# EasyEDA Pro project ProProject_esp32s3_reye_2023-09-05.epro

# Schematic Schematic1
Create Date: 2023-08-01; Page Name: P1; Project Name: esp32s3_reye; Schematic Name: Schematic1; Update Date: 2023-08-22; Company: 嘉立创EDA; Page Size: A4; Version: V1.0
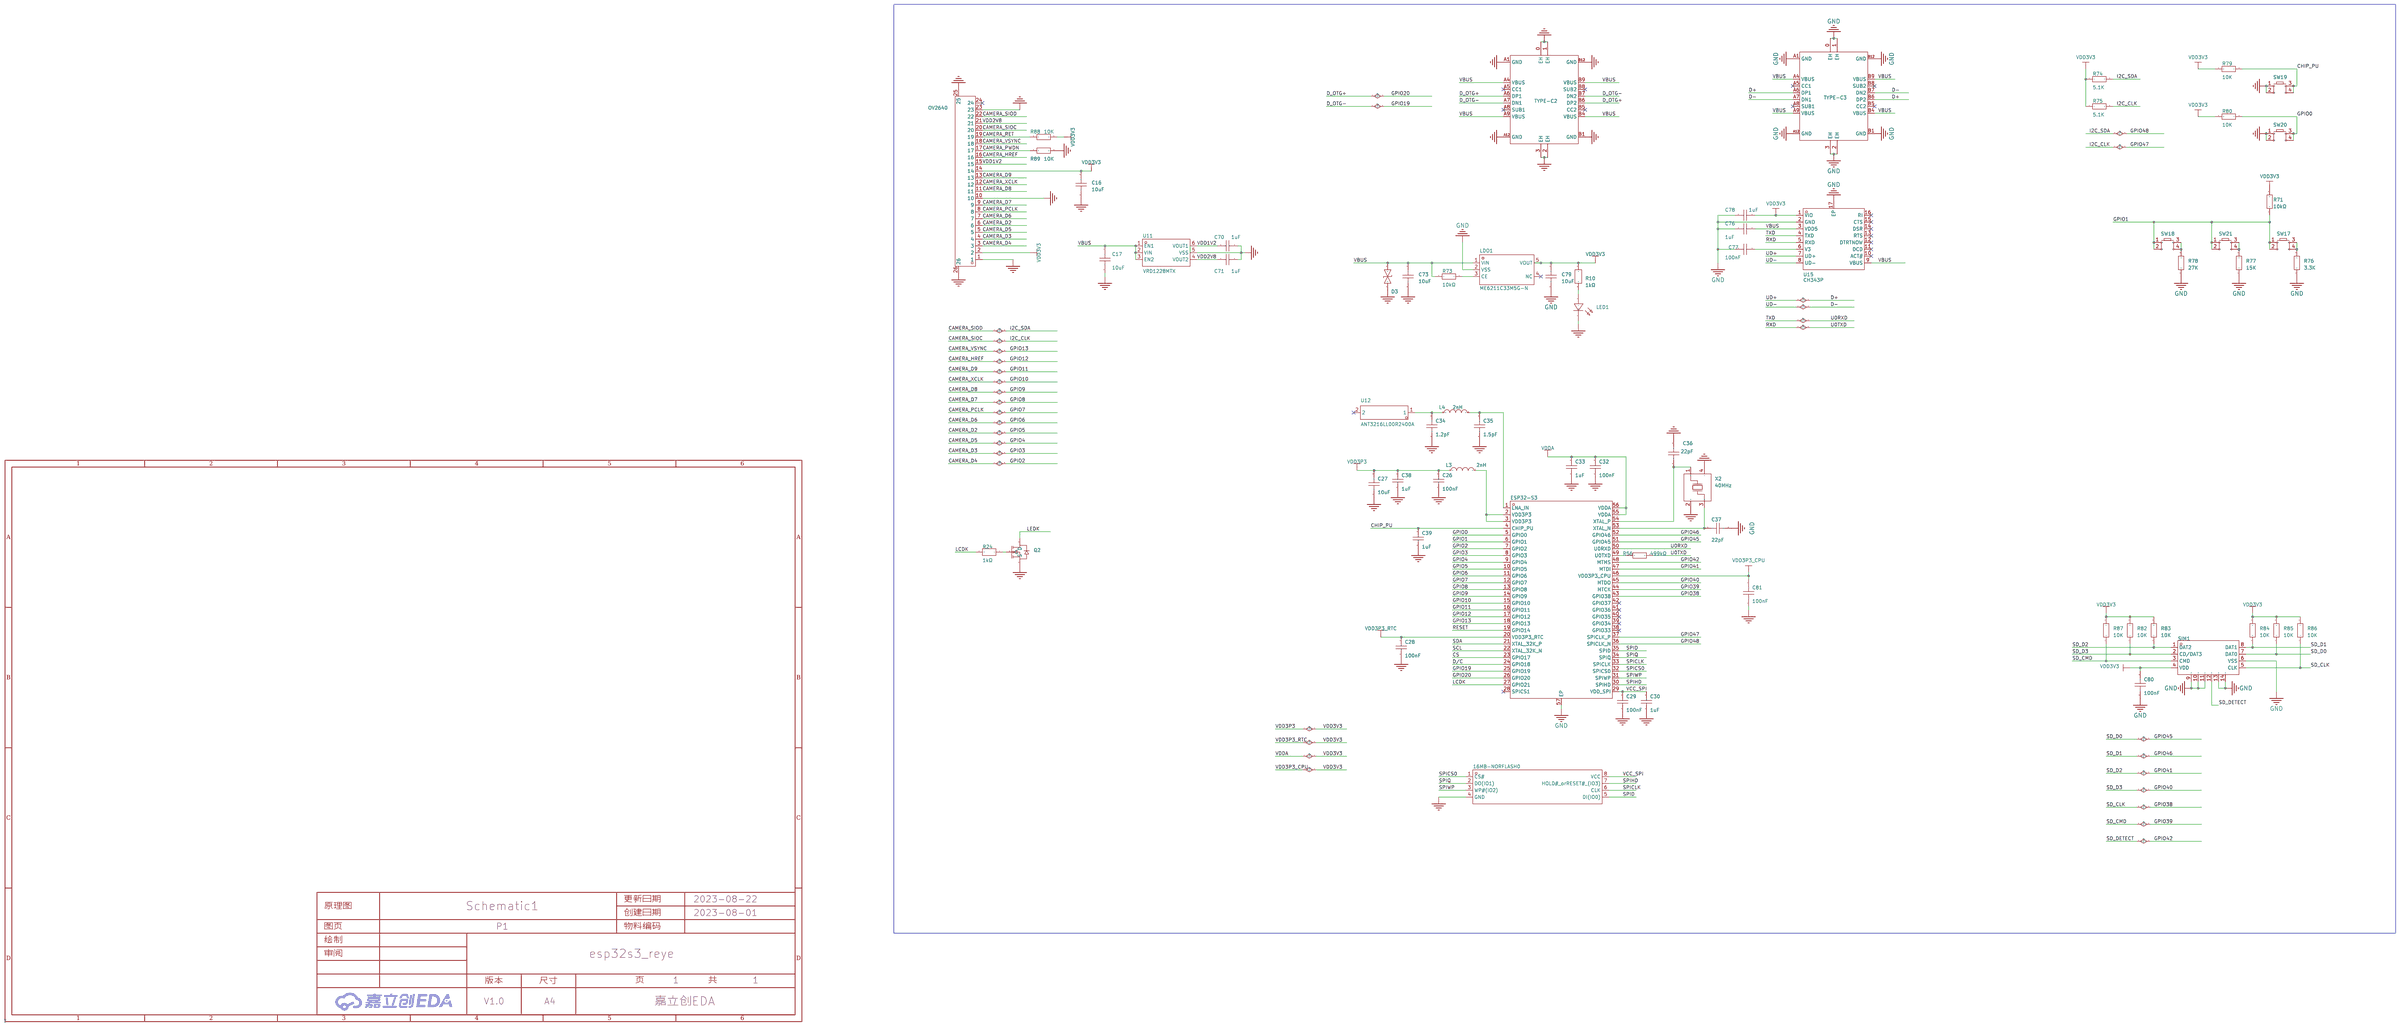
[diagram p0: schematic sheet]

## Parts
16MB-NORFLASH0  W25Q128JWSIQ  [SOIC-8_L5.3-W5.3-P1.27-LS8.0-BL]
C16  10uF  [c0402_new]
C17  10uF  [c0402_new]
C26  100nF  [c0402_new]
C27  10uF  [c0402_new]
C28  100nF  [c0402_new]
C29  100nF  [c0402_new]
C30  1uF  [c0402_new]
C32  100nF  [c0402_new]
C33  1uF  [c0402_new]
C34  1.2pF  [c0402_new]
C35  1.5pF  [c0402_new]
C36  22pF  [c0402_new]
C37  22pF  [c0402_new]
C38  1uF  [c0402_new]
C39  1uF  [c0402_new]
C70  1uF  [c0402_new]
C71  1uF  [c0402_new]
C73  10uF  [c0402_new]
C76  1uF  [c0402_new]
C77  100nF  [c0402_new]
C78  1uF  [c0402_new]
C79  10uF  [c0402_new]
C80  100nF  [C0402]
C81  100nF  [C0402]
D3  LESD5D5.0CT1G  [SOD-523_L1.2-W0.8-LS1.6-BI]
ESP32-S3  -  [QFN-56_L7.0-W7.0-P0.40-TL-EP4.0]
L3  2nH  [l0402]
L4  2nH  [l0402]
LDO1  ME6211C33M5G-N  [SOT-23-5_L3.0-W1.7-P0.95-LS2.8-BL]
LED1  -  [LED_0402]
OV2640  0.5-24P XGXJ-H2.0 119  [FPC-SMD_24P-P0.50_SHOU-HAN_XGXJ-H2.0]
Q2  -  [SOT-23-3_L2.9-W1.3-P1.90-LS2.4-BR]
R10  1kΩ  [r0402]
R24  1kΩ  [r0402]
R56  499kΩ  [R0402]
R71  10kΩ  [R0402]
R73  10kΩ  [R0402]
R74  5.1K  [R0402]
R75  5.1K  [R0402]
R76  3.3K  [R0402]
R77  15K  [R0402]
R78  27K  [R0402]
R79  10K  [R0402]
R80  10K  [R0402]
R82  10K  [R0402]
R83  10K  [R0402]
R84  10K  [R0402]
R85  10K  [R0402]
R86  10K  [R0402]
R87  10K  [R0402]
R88  10K  [R0402]
R89  10K  [R0402]
SIM1  1040310811  [SIM-SMD_8P-1040310811]
SW17  -  [Key_SMD_4.2x3.2x2.5]
SW18  -  [Key_SMD_4.2x3.2x2.5]
SW19  -  [Key_SMD_4.2x3.2x2.5]
SW20  -  [Key_SMD_4.2x3.2x2.5]
SW21  -  [Key_SMD_4.2x3.2x2.5]
TYPE-C2  -  [USB-C_SMD-TYPE-C-31-M-12]
TYPE-C3  -  [USB-C_SMD-TYPE-C-31-M-12]
U11  VRD1228MTX  [SOT-23-6_L2.9-W1.6-P0.95-LS2.8-BL]
U12  ANT3216LL00R2400A  [ANT-SMD_L3.2-W1.6]
U15  CH343P  [TQFN-16_L3.0-W3.0-P0.50-BL-EP1.7]
X2  40MHz  [CRYSTAL-SMD_4P-L2.0-W1.6-BL]

## Library data of the parts
16MB-NORFLASH0 = W25Q128JWSIQ: 存储器类型:-;存储器构架(格式):-;技术:-;存储器容量:-;时钟频率:-;存储器接口类型:-;; Supplier Part: C2763561; Manufacturer: WINBOND(华邦); Supplier Footprint: SOIC-8_208mil; JLCPCB Part Class: 扩展库; Datasheet: https://atta.szlcsc.com/upload/public/pdf/source/20210205/C2689660_0A4E5314E2A3675FAC38C43AF39F6008.pdf; Supplier: LCSC; Check: true
C16 C17 C73 C79 = CL10A106KP8NNNC: 容值:10uF;精度:±10%;额定电压:10V;材质(温度系数):X5R;; LCSC Part Name: 10uF ±10% 10V; Supplier Part: C19702; Manufacturer: SAMSUNG(三星); Supplier Footprint: 0603; JLCPCB Part Class: 基础库; Datasheet: https://atta.szlcsc.com/upload/public/pdf/source/20160103/1457707703378.pdf; Supplier: LCSC; Tolerance: ±10%; Voltage Rated: 10V; Temperature Coefficient: X5R; Check: true
C26 C28 C29 C32 = CL10F104ZB8NNNC: 容值:100nF;精度:-20%~+80%;额定电压:50V;温度系数:Y5V;; LCSC Part Name: 100nF(104) +80,-20% 50V; Supplier Part: C1688; Manufacturer: SAMSUNG(三星); Supplier Footprint: 0603; JLCPCB Part Class: Extended Part; Datasheet: https://atta.szlcsc.com/upload/public/pdf/source/20160103/1457707690730.pdf; Supplier: LCSC; Tolerance: -20%~+80%; Voltage Rated: 50V; Temperature Coefficient: Y5V; Check: true
C27 = ZRB15XR61A106ME01D: 容值:10uF;精度:±20%;额定电压:-;温度系数:-;; LCSC Part Name: 10uF ±20% 10V X5R; Supplier Part: C527590; Manufacturer: muRata(村田); Supplier Footprint: 0402; JLCPCB Part Class: Extended Part; Datasheet: https://atta.szlcsc.com/upload/public/pdf/source/20200507/C527590_05B2D18D24F6232E70970638CDBF66E1.pdf; Supplier: LCSC; Tolerance: ±20%; Check: true
C30 C33 C38 C39 = CC0603KRX5R8BB105: 容值:1uF;精度:±10%;额定电压:25V;温度系数:X5R;; LCSC Part Name: 1uF ±10% 25V; Supplier Part: C14664; Manufacturer: YAGEO(国巨); Supplier Footprint: 0603; JLCPCB Part Class: Extended Part; Datasheet: https://atta.szlcsc.com/upload/public/pdf/source/20160606/1465200209684.pdf; Supplier: LCSC; Tolerance: ±10%; Voltage Rated: 25V; Temperature Coefficient: X5R; Check: true
C34 = C0201C0G1R2C500NTA: 容值:1.2pF;精度:±0.25pF;额定电压:50V;温度系数:C0G;; LCSC Part Name: 1.2pF ±0.25pF 50V; Supplier Part: C124764; Manufacturer: EYANG(宇阳科技); Supplier Footprint: 0201; Datasheet: https://atta.szlcsc.com/upload/public/pdf/source/20180705/C124764_534E68D6EB59C04BA11707FF5E90CC47.pdf; Supplier: LCSC; Tolerance: ±0.25pF; Voltage Rated: 50V; Temperature Coefficient: C0G; Check: true
C35 = C1608C0G1H1R5CT000N: 容值:1.5pF;精度:±0.25pF;额定电压:50V;温度系数:C0G;; LCSC Part Name: 1.5pF ±0.25pF 50V; Supplier Part: C695130; Manufacturer: TDK; Supplier Footprint: 0603; JLCPCB Part Class: Extended Part; Datasheet: https://atta.szlcsc.com/upload/public/pdf/source/20191008/C432930_1569A900251E35B50161EFC1E9A1C511.pdf; Supplier: LCSC; Tolerance: ±0.25pF; Voltage Rated: 50V; Temperature Coefficient: C0G; Check: true
C36 C37 = C0402C0G220J500NTB: 容值:22pF;精度:±5%;额定电压:50V;温度系数:C0G;; LCSC Part Name: 22pF ±5% 50V; Supplier Part: C115618; Manufacturer: EYANG(宇阳科技); Supplier Footprint: 0402; JLCPCB Part Class: Extended Part; Datasheet: https://atta.szlcsc.com/upload/public/pdf/source/20170616/1497588087268.pdf; Supplier: LCSC; Tolerance: ±5%; Voltage Rated: 50V; Temperature Coefficient: C0G; Check: true
C70 C71 = CL05A105KP5NNNC: 容值:1uF;精度:±10%;额定电压:10V;材质(温度系数):X5R;; LCSC Part Name: 1uF ±10% 10V; Supplier Part: C14445; Manufacturer: SAMSUNG(三星); Supplier Footprint: 0402; JLCPCB Part Class: 扩展库; Datasheet: https://atta.szlcsc.com/upload/public/pdf/source/20160103/1457707670698.pdf; Supplier: LCSC; Tolerance: ±10%; Voltage Rated: 10V; Temperature Coefficient: X5R
C76-C78 = CL05B104KO5NNNC: 容值:100nF;精度:±10%;额定电压:16V;材质(温度系数):X7R;; LCSC Part Name: 100nF ±10% 16V; Supplier Part: C1525; Manufacturer: SAMSUNG(三星); Supplier Footprint: 0402; JLCPCB Part Class: 基础库; Datasheet: https://atta.szlcsc.com/upload/public/pdf/source/20160103/1457707674891.pdf; Supplier: LCSC; Tolerance: ±10%; Voltage Rated: 16V; Temperature Coefficient: X7R; Check: true
C80 C81 = CAP_0603: Supplier Footprint: 0603
D3 = LESD5D5.0CT1G: 极性:双向;反向截止电压(Vrwm):5V;击穿电压(VBR):5.6V;峰值脉冲电流(Ipp)@8/20us:9.4A;钳位电压(Vc)@Ipp:18.6V;; Supplier Part: C383211; Manufacturer: LRC(乐山无线电); Supplier Footprint: SOD-523; JLCPCB Part Class: 扩展库; Datasheet: https://atta.szlcsc.com/upload/public/pdf/source/20190807/C383211_633DF4B4E2C161403226E5235FE33A1C.pdf; Supplier: LCSC; Polarity: 双向; Reverse Stand-Off Voltage (Vrwm): 5V; Breakdown Voltage (VBR): 5.6V; Peak Pulse Current(Ipp)@8/20us: 9.4A; Clamping Voltage@Ipp: 18.6V
ESP32-S3 = ESP32-S3: Supplier Part: C2913192; Manufacturer: ESPRESSIF 乐鑫; Supplier Footprint: QFN56(7x7); JLCPCB Part Class: Extended Part; Datasheet: https://atta.szlcsc.com/upload/public/pdf/source/20220211/8CA5C1C53CA8E3D1871752073201D38A.pdf; Supplier: LCSC; Check: true
L3 L4 = VHF100505H2N0ST: 电感值:2nH;精度:±0.3nH;额定电流:-;饱和电流(Isat):-;直流电阻(DCR):-;; LCSC Part Name: 2nH ±0.3nH; Supplier Part: C90190; Manufacturer: FH(风华); Supplier Footprint: 0402; JLCPCB Part Class: Extended Part; Datasheet: https://atta.szlcsc.com/upload/public/pdf/source/20170105/1483610760484.pdf; Supplier: LCSC; Tolerance: ±0.3nH; Check: true
LDO1 = ME6211C33M5G-N: 输出类型:固定;输出极性:正;最大输入电压:6V;输出电压:3.3V;输出电流:500mA;电源纹波抑制比(PSRR):70dB;; Supplier Part: C82942; Manufacturer: MICRONE(南京微盟); Supplier Footprint: SOT-23-5; JLCPCB Part Class: 扩展库; Datasheet: https://atta.szlcsc.com/upload/public/pdf/source/20170918/C82942_1505727073070976520.pdf; Supplier: LCSC; Output Type: 固定; Output Polarity: 正; Number of Outputs: 1; Maximum Input Voltage: 6V; Output Voltage: 3.3V; Dropout Voltage: 260mV@(200mA); Output Current: 500mA; Power Supply Rejection Ratio (PSRR): 70dB
LED1 = LED_0402-B: Supplier Footprint: 0402
OV2640 = 0.5-24P XGXJ-H2.0 119: 间距:0.5mm;触点数量:24;锁定特性:翻盖式;安装类型:卧贴;触点类型:下接;工作温度范围:-25~+85;焊接温度(最大值):-;; LCSC Part Name: 0.5mm P数:24 翻盖式 下接; Supplier Part: C2858298; Manufacturer: SHOU HAN(首韩); Supplier Footprint: SMD,P=0.5mm; JLCPCB Part Class: 扩展库; Datasheet: https://atta.szlcsc.com/upload/public/pdf/source/20210802/C2858298_BB8979DCA7417C71CCCA565E5B82BFE8.pdf; Supplier: LCSC; Pitch: 0.5mm; Number of Contacts: 24; Locking Feature: 翻盖式; Mounting Type: 卧贴; Contact Type: 下接; Height Above Board: 2mm; FFC, FCB Thickness: 0.3mm; Operating Temperature Range: -25~+85
Q2 = AO3400A_N: 类型:N沟道;漏源电压(Vdss):30V;连续漏极电流(Id):5.2A;功率(Pd):1W;导通电阻(RDS(on)@Vgs,Id):35mΩ@10V,5A;阈值电压(Vgs(th)@Id):1.5V@250A;; Supplier Footprint: SOT-23; Supplier Part: C700953
R10 R24 = SCR0402F1K: 阻值:1kΩ;精度:±1%;; LCSC Part Name: 1kΩ ±1%; Supplier Part: C3015791; Manufacturer: VO(翔胜); Supplier Footprint: 0402; JLCPCB Part Class: 扩展库; Datasheet: https://atta.szlcsc.com/upload/public/pdf/source/20220513/247AF9639BA21CF93567DC289CCC6A22.pdf; Supplier: LCSC; Tolerance: ±1%; Check: true
R56 = RC0805FR-07499KL: 阻值:499kΩ;精度:±1%;功率:125mW;温度系数:±100ppm/;最大工作电压:150V;工作温度范围:-55~+155;; LCSC Part Name: 499kΩ ±1%; Supplier Part: C274360; Manufacturer: YAGEO(国巨); Supplier Footprint: 0805; JLCPCB Part Class: Extended Part; Datasheet: https://atta.szlcsc.com/upload/public/pdf/source/20180821/C274360_D911D0A34FE8823B2C88EB89A26F81EA.pdf; Supplier: LCSC; Tolerance: ±1%; Power(Watts): 125mW; Temperature Coefficient: ±100ppm/; Overload Voltage (Max): 150V; Operating Temperature Range: -55~+155; Check: true
R71 R73 = 0402WGF1002TCE: 电阻类型:厚膜电阻;阻值:10kΩ;精度:±1%;功率:62.5mW;; LCSC Part Name: 10kΩ ±1% 62.5mW; Supplier Part: C25744; Manufacturer: UNI-ROYAL(厚声); Supplier Footprint: 0402; JLCPCB Part Class: 基础库; Datasheet: https://atta.szlcsc.com/upload/public/pdf/source/20200306/C422600_1E6D84923E4A46A82E41ADD87F860B5C.pdf; Supplier: LCSC; Type: 厚膜电阻; Tolerance: ±1%; Power(Watts): 62.5mW; Temperature Coefficient: ±100ppm/℃; Overload Voltage (Max): 50V; Operating Temperature Range: -55℃~+155℃
R74-R80 R82-R89 = Res_0603: Supplier Footprint: 0603
SIM1 = 1040310811: 卡连接方式:拔插式;卡类型:MicroSD卡(TF卡);连接器类型:卡座;本体最大高度:1.42mm;工作温度范围:-;; LCSC Part Name: 拔插式 MicroSD卡(TF卡) 卡座; Supplier Part: C585350; Manufacturer: MOLEX; Supplier Footprint: SMD; JLCPCB Part Class: 扩展库; Datasheet: https://atta.szlcsc.com/upload/public/pdf/source/20201117/C585350_D1F0B30BD23514449186B2E50ACE8BBF.pdf; Supplier: LCSC; Card Connection Mode: 拔插式; Card Type: MicroSD卡(TF卡); Connector Type: 卡座; Maximum Body Height: 1.42mm
SW17-SW21 = Key_SMD_4.2x3.2x2.5: Supplier Footprint: SMD
TYPE-C2 TYPE-C3 = TYPEC-304A-ACP16W: 连接器类型:Type-C;标准:USB 3.1;公母:母座;触点数量:16;端口数量:1;安装方式:卧贴;额定电流 - 电源:5A;工作温度范围:-45~+85;焊接温度(最大值):260;; LCSC Part Name: Type-C 母座 卧贴; Supplier Part: C2909607; Manufacturer: XUNPU(讯普); Supplier Footprint: SMD,8.94x7.35x3.26mm; JLCPCB Part Class: Extended Part; Datasheet: https://atta.szlcsc.com/upload/public/pdf/source/20211029/5A76838C591B377E5BF09726BF37DE5A.pdf; Supplier: LCSC; Connector Type: Type-C; Standard: USB 3.1; Gender: 母座; Number of Contacts: 16; Number of Ports: 1; Mounting Style: 卧贴; Current Rating - Power (Max): 5A; Operating Temperature Range: -45~+85; Welding Temperature (Max): 260; Check: true
U11 = VRD1228MTX: 输出类型:-;输出通道数:2;最大输入电压:6V;输出电压:1.2V；2.8V;压差:90mV;静态电流(地电流):25uA;输出电流:300mA;电源纹波抑制比(PSRR):75dB@1kHz;; LCSC Part Name: Vin=6V Vout=1.2V Vout=2.8V 300mA 75dB@1kHz; Supplier Part: C697901; Manufacturer: AnaSem(安纳森); Supplier Footprint: SOT-23-6; JLCPCB Part Class: 扩展库; Datasheet: https://atta.szlcsc.com/upload/public/pdf/source/20200708/C697892_C8B70D18CFBEB7CFBCE9715F77B0116B.pdf; Supplier: LCSC; Number of Outputs: 2; Maximum Input Voltage: 6V; Output Voltage: 1.2V；2.8V; Dropout Voltage: 90mV; Quiescent Current (Ground Current): 25uA; Output Current: 300mA; Power Supply Rejection Ratio (PSRR): 75dB@1kHz
U12 = ANT3216LL00R2400A: 2.4 - 2.5 GHz; Supplier Part: C293767; Manufacturer: YAGEO(国巨); Supplier Footprint: 1206; JLCPCB Part Class: 扩展库; Datasheet: https://atta.szlcsc.com/upload/public/pdf/source/20181012/C293767_CDE82A2F74DC82A94DB708CB53B68F23.pdf; Supplier: LCSC
U15 = CH343P: 类型:-;协议类别:-;驱动器/接收器数:-;数据速率:-;; Supplier Part: C2846043; Manufacturer: WCH(南京沁恒); Supplier Footprint: QFN-16; Datasheet: https://atta.szlcsc.com/upload/public/pdf/source/20211010/C2846043_7FA705E1F14A2906F6A2AFA45FA28209.pdf; Supplier: LCSC
X2 = Q22FA12800101: 晶振类型:贴片无源晶振;频率:40MHz;频率公差:±10ppm;频率稳定度:-;负载电容:10pF;等效串联电阻(ESR):60Ω;工作温度:-40~+85;; LCSC Part Name: 40MHz ±10ppm 10pF; Supplier Part: C255898; Manufacturer: EPSON(爱普生); Supplier Footprint: SMD2016-4P; JLCPCB Part Class: Extended Part; Datasheet: https://atta.szlcsc.com/upload/public/pdf/source/20180822/C255898_1817DB2E39C9CD12791B484C3BDD93C5.pdf; Supplier: LCSC; Crystal Type: 贴片无源晶振; Frequency Tolerance: ±10ppm; Load Capacitance: 10pF; Equivalent Series Resistance (ESR): 60Ω; Operating Temperature: -40~+85; Check: true

## Nets
GND: 16MB-NORFLASH0.4(GND) C16.1 C17.2 C26.1 C27.1 C28.1 C29.1 C30.1 C32.1 C33.1 C34.1 C35.1 C36.2 C37.2 C38.1 C39.1 C70.2 C71.2 C73.2 C76.1 C77.1 C78.1 C79.2 C80.2 C81.2 D3.1 ESP32-S3.57(EP) LDO1.2(VSS) LED1.1(C) OV2640.1 OV2640.10 OV2640.23 OV2640.25 OV2640.26 Q2.2(S) R76.1 R77.1 R78.1 R89.2 SIM1.6(VSS) SIM1.9 SIM1.10 SIM1.11 SIM1.13 SIM1.14 SW19.1 SW19.2 SW20.1 SW20.2 TYPE-C2.0(EH) TYPE-C2.1(EH) TYPE-C2.2(EH) TYPE-C2.3(EH) TYPE-C2.A1(GND) TYPE-C2.A12(GND) TYPE-C2.B1(GND) TYPE-C2.B12(GND) TYPE-C3.0(EH) TYPE-C3.1(EH) TYPE-C3.2(EH) TYPE-C3.3(EH) TYPE-C3.A1(GND) TYPE-C3.A12(GND) TYPE-C3.B1(GND) TYPE-C3.B12(GND) U11.5(VSS) U15.2(GND) U15.17(EP) X2.2 X2.4
VBUS: C17.1 C73.1 C76.2 D3.2 LDO1.1(VIN) R73.2 TYPE-C2.A4(VBUS) TYPE-C2.A9(VBUS) TYPE-C2.B4(VBUS) TYPE-C2.B9(VBUS) TYPE-C3.A4(VBUS) TYPE-C3.A9(VBUS) TYPE-C3.B4(VBUS) TYPE-C3.B9(VBUS) U11.1(EN1) U11.2(VIN) U11.3(EN2) U15.3(VDD5) U15.9(VBUS)
VCC_SPI: 16MB-NORFLASH0.8(VCC) C29.2 C30.2 ESP32-S3.29(VDD_SPI)
VDD1V2: C70.1 OV2640.15 U11.6(VOUT1)
VDD2V8: C71.1 OV2640.21 U11.4(VOUT2)
VDD3P3: C16.2 C26.2 C27.2 C28.2 C32.2 C33.2 C38.2 C78.2 C79.1 C80.1 C81.1 ESP32-S3.20(VDD3P3_RTC) ESP32-S3.46(VDD3P3_CPU) ESP32-S3.55(VDDA) ESP32-S3.56(VDDA) L3.1 LDO1.5(VOUT) OV2640.2 OV2640.14 R10.1 R71.2 R74.1 R75.1 R79.1 R80.1 R82.2 R83.2 R84.2 R85.2 R86.2 R87.2 R88.2 SIM1.4(VDD) U15.1(VIO)
CAMERA_D2: ESP32-S3.10(GPIO5) OV2640.6
CAMERA_D3: ESP32-S3.8(GPIO3) OV2640.4
CAMERA_D4: ESP32-S3.7(GPIO2) OV2640.3
CAMERA_D5: ESP32-S3.9(GPIO4) OV2640.5
CAMERA_D6: ESP32-S3.11(GPIO6) OV2640.7
CAMERA_D7: ESP32-S3.13(GPIO8) OV2640.9
CAMERA_D8: ESP32-S3.14(GPIO9) OV2640.11
CAMERA_D9: ESP32-S3.16(GPIO11) OV2640.13
CAMERA_HREF: ESP32-S3.17(GPIO12) OV2640.16
CAMERA_PCLK: ESP32-S3.12(GPIO7) OV2640.8
CAMERA_PWDN: OV2640.17 R89.1
CAMERA_RET: OV2640.19 R88.1
CAMERA_SIOC: ESP32-S3.37(SPICLK_P) OV2640.20 R75.2
CAMERA_SIOD: ESP32-S3.36(SPICLK_N) OV2640.22 R74.2
CAMERA_VSYNC: ESP32-S3.18(GPIO13) OV2640.18
CAMERA_XCLK: ESP32-S3.15(GPIO10) OV2640.12
CHIP_PU: C39.2 ESP32-S3.4(CHIP_PU) R79.2 SW19.3 SW19.4
CS: ESP32-S3.23(GPIO17)
D+: TYPE-C3.A6(DP1) TYPE-C3.B6(DP2) U15.7(UD+)
D-: TYPE-C3.A7(DN1) TYPE-C3.B7(DN2) U15.8(UD-)
D/C: ESP32-S3.24(GPIO18)
D_OTG+: ESP32-S3.26(GPIO20) TYPE-C2.A6(DP1) TYPE-C2.B6(DP2)
D_OTG-: ESP32-S3.25(GPIO19) TYPE-C2.A7(DN1) TYPE-C2.B7(DN2)
GPIO0: ESP32-S3.5(GPIO0) R80.2 SW20.3 SW20.4
GPIO1: ESP32-S3.6(GPIO1) R71.1 SW17.1 SW17.2 SW18.1 SW18.2 SW21.1 SW21.2
GPIO38: ESP32-S3.43(GPIO38) R86.1 SIM1.5(CLK)
GPIO39: ESP32-S3.44(MTCK) R87.1 SIM1.3(CMD)
GPIO40: ESP32-S3.45(MTDO) R82.1 SIM1.2(CD/DAT3)
GPIO41: ESP32-S3.47(MTDI) R83.1 SIM1.1(DAT2)
GPIO42: ESP32-S3.48(MTMS) SIM1.12
GPIO45: ESP32-S3.51(GPIO45) R85.1 SIM1.7(DAT0)
GPIO46: ESP32-S3.52(GPIO46) R84.1 SIM1.8(DAT1)
LCDK: ESP32-S3.27(GPIO21) R24.2
LEDK: Q2.3(D)
RESET: ESP32-S3.19(GPIO14)
RXD: R56.2 U15.5(RXD)
SCL: ESP32-S3.22(XTAL_32K_N)
SDA: ESP32-S3.21(XTAL_32K_P)
SPICLK: 16MB-NORFLASH0.6(CLK) ESP32-S3.33(SPICLK)
SPICS0: 16MB-NORFLASH0.1(CS#) ESP32-S3.32(SPICS0)
SPID: 16MB-NORFLASH0.5(DI(IO0)) ESP32-S3.35(SPID)
SPIHD: 16MB-NORFLASH0.7(HOLD# orRESET# (IO3)) ESP32-S3.30(SPIHD)
SPIQ: 16MB-NORFLASH0.2(DO(IO1)) ESP32-S3.34(SPIQ)
SPIWP: 16MB-NORFLASH0.3(WP#(IO2)) ESP32-S3.31(SPIWP)
TXD: ESP32-S3.50(U0RXD) U15.4(TXD)
$1N4290: ESP32-S3.49(U0TXD) R56.1
$1N4308: C37.1 ESP32-S3.53(XTAL_N) X2.3(OSC2)
$1N4325: ESP32-S3.2(VDD3P3) ESP32-S3.3(VDD3P3) L3.2
$1N4347: C35.2 ESP32-S3.1(LNA_IN) L4.2
$1N4357: C34.2 L4.1 U12.1
$1N6114: LED1.2(A) R10.2
$1N8529: C77.2 U15.6(V3)
$1N9307: R78.2 SW18.3 SW18.4
$1N9342: R77.2 SW21.3 SW21.4
$1N11471: R76.2 SW17.3 SW17.4
$1N13673: C36.1 ESP32-S3.54(XTAL_P) X2.1(OSC1)
$1N21988: Q2.1(G) R24.1
$1N24418: LDO1.3(CE) R73.1

Not connected (* = marked no-connect by the designer): ESP32-S3 28(SPICS1)* 38(GPIO33)* 39(GPIO34)* 40(GPIO35)* 41(GPIO36)* 42(GPIO37)*; LDO1 4(NC)*; OV2640 24*; TYPE-C2 A5(CC1)* A8(SUB1)* B5(CC2)* B8(SUB2)*; TYPE-C3 A5(CC1)* A8(SUB1)* B5(CC2)* B8(SUB2)*; U12 2*; U15 10(ACT#)* 11(DCD)* 12(DTRTNOW)* 13(RTS)* 14(DSR)* 15(CTS)* 16(RI)*

# Board PCB1
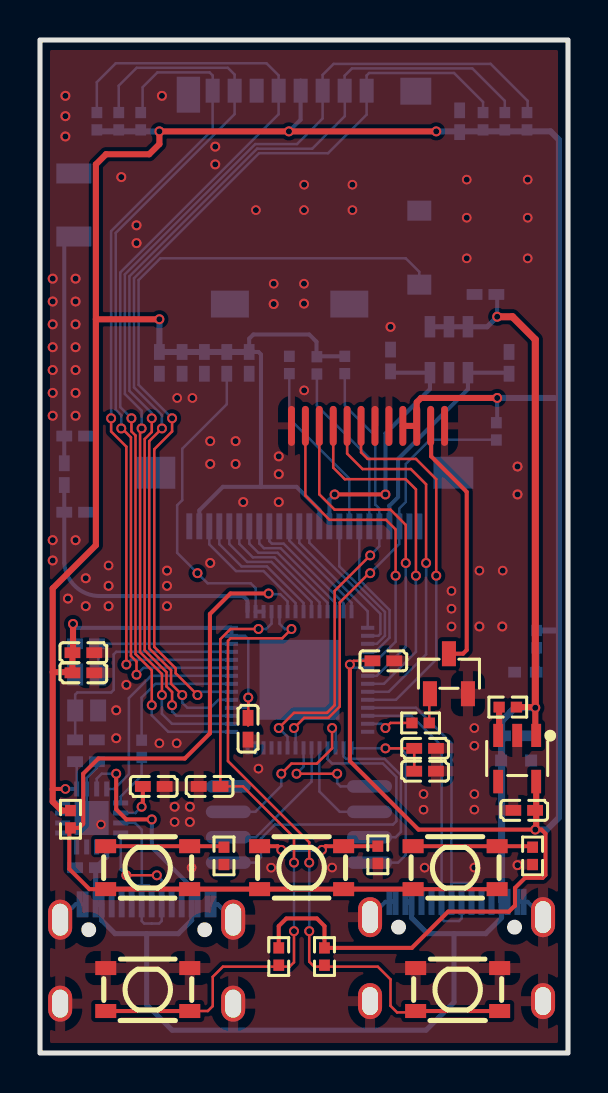
[diagram p1: board, top side]
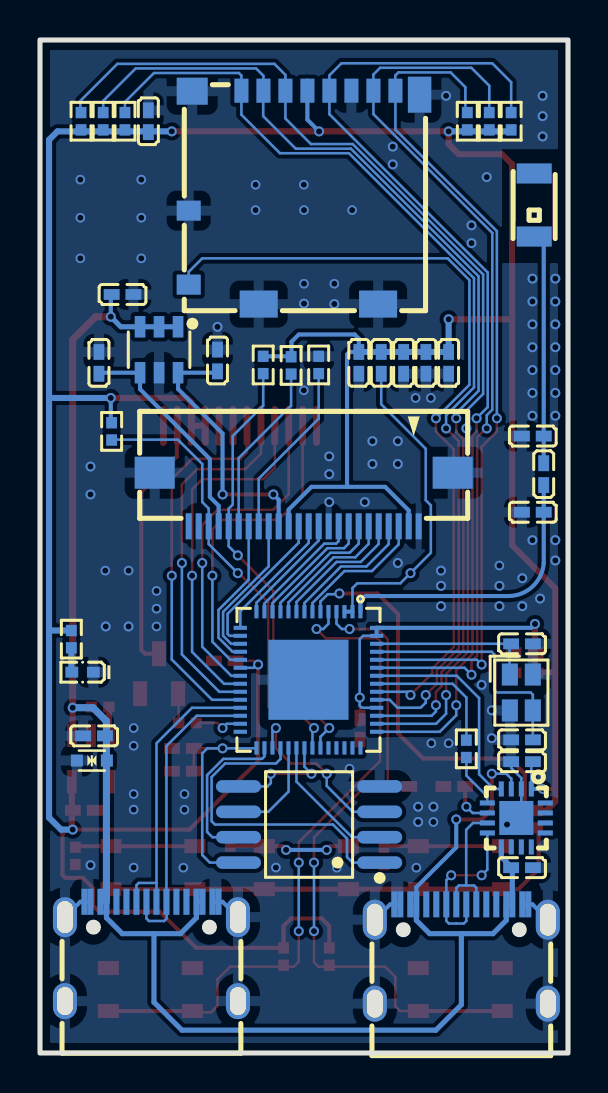
[diagram p2: board, bottom side, seen from below]

Outline 26.4 x 50.67 mm; copper layers: Top Layer, Bottom Layer. Coordinates in mm from the lower left corner of the outline.
Outline path: rectangle 0,50.67 26.4,0
Stack: Top Layer 0.035mm / Dielectric1 1.51mm FR4 er 4.5 / Bottom Layer 0.035mm

## Design rules (mm)
template: 自定义配置
spacing copperThickness1oz (default): track to track 0.102, other pairs 0.152 to 0.3
spacing copperThickness2oz: track to track 0.203, other pairs 0.152 to 0.3
track width copperThickness1oz (default): min 0.127, default 0.254, max 2.54
track width copperThickness2oz: min 0.203, default 0.254, max 2.54
differential pair differentialPair (default): width min 0.127, default 0.254, max 2.54; gap min 0.152, default 0.152
via viaSize (default): diameter min 0.483, default 0.61, max 10; hole min 0.305, default 0.305, max 6.3

## Placement (name value [footprint] x y rotation side)
16MB-NORFLASH0  W25Q128JWSIQ  [SOIC-8_L5.3-W5.3-P1.27-LS8.0-BL]  12.95 11.43 90 bottom
C16  10uF  [c0402_new]  10.46 34.52 90 bottom
C17  10uF  [c0402_new]  22.27 37.94 180 bottom
C26  100nF  [c0402_new]  8.22 34.52 90 bottom
C27  10uF  [c0402_new]  5.97 34.52 90 bottom
C28  100nF  [c0402_new]  17.17 19.62 180 top
C29  100nF  [c0402_new]  19.25 15.24 180 top
C30  1uF  [c0402_new]  19.25 14.1 180 top
C32  100nF  [c0402_new]  2.17 20.02 180 top
C33  1uF  [c0402_new]  2.17 19.02 180 top
C34  1.2pF  [c0402_new]  1.76 30.86 180 bottom
C35  1.5pF  [c0402_new]  1.76 27.05 180 bottom
C36  22pF  [c0402_new]  2.3 20.47 180 bottom
C37  22pF  [c0402_new]  2.3 15.67 0 bottom
C38  1uF  [c0402_new]  7.1 34.52 90 bottom
C39  1uF  [c0402_new]  8.48 13.34 0 top
C70  1uF  [c0402_new]  17.53 34.64 90 bottom
C71  1uF  [c0402_new]  23.45 34.52 90 bottom
C73  10uF  [c0402_new]  23.7 15.86 0 bottom
C76  1uF  [c0402_new]  2.3 9.27 0 bottom
C77  100nF  [c0402_new]  5.69 13.34 180 top
C78  1uF  [c0402_new]  2.3 14.57 180 bottom
C79  10uF  [c0402_new]  24.21 12.14 180 top
C80  100nF  [C0402]  20.98 46.61 90 bottom
C81  100nF  [C0402]  10.4 16.22 270 top
D3  LESD5D5.0CT1G  [SOD-523_L1.2-W0.8-LS1.6-BI]  23.81 14.63 180 bottom
ESP32-S3  -  [QFN-56_L7.0-W7.0-P0.40-TL-EP4.0]  12.98 18.67 270 bottom
L3  2nH  [l0402]  9.34 34.52 270 bottom
L4  2nH  [l0402]  1.21 28.96 270 bottom
LDO1  ME6211C33M5G-N  [SOT-23-5_L3.0-W1.7-P0.95-LS2.8-BL]  23.86 14.73 180 top
LED1  -  [LED_0402]  24.27 19.05 0 bottom
NOREF  -  [Pad_e40]  16.05 31.37 0 top
NOREF#2  -  [Pad_e58]  18.14 31.37 0 top
NOREF#3  -  [Pad_e57]  17.44 31.37 0 top
NOREF#4  -  [Pad_e59]  18.84 31.37 0 top
NOREF#5  -  [Pad_e41]  16.75 31.37 0 top
NOREF#6  -  [Pad_e64]  13.27 31.37 0 top
NOREF#7  -  [Pad_e65]  12.57 31.37 0 top
NOREF#8  -  [Pad_e62]  14.66 31.37 0 top
NOREF#9  -  [Pad_e61]  19.53 31.37 0 top
NOREF#10  -  [Pad_e60]  20.23 31.37 0 top
NOREF#11  -  [Pad_e27]  15.36 31.37 0 top
NOREF#12  -  [Pad_e63]  13.97 31.37 0 top
OV2640  0.5-24P XGXJ-H2.0 119  [FPC-SMD_24P-P0.50_SHOU-HAN_XGXJ-H2.0]  13.22 27.69 0 bottom
Q2  -  [SOT-23-3_L2.9-W1.3-P1.90-LS2.4-BR]  20.45 18.97 270 top
R10  1kΩ  [r0402]  24.83 20.7 270 bottom
R24  1kΩ  [r0402]  19.03 16.51 180 top
R56  499kΩ  [R0402]  5.08 15.22 270 bottom
R71  10kΩ  [R0402]  1.52 11.69 90 top
R73  10kΩ  [R0402]  23.39 17.3 0 top
R74  5.1K  [R0402]  22.82 31.09 270 bottom
R75  5.1K  [R0402]  15.24 34.42 270 bottom
R76  3.3K  [R0402]  24.63 9.86 90 top
R77  15K  [R0402]  16.89 9.91 90 top
R78  27K  [R0402]  9.2 9.86 90 top
R79  10K  [R0402]  11.94 4.83 270 top
R80  10K  [R0402]  14.22 4.83 270 top
R82  10K  [R0402]  23.24 46.61 270 bottom
R83  10K  [R0402]  22.15 46.61 270 bottom
R84  10K  [R0402]  5.04 46.61 270 bottom
R85  10K  [R0402]  3.94 46.61 270 bottom
R86  10K  [R0402]  2.84 46.61 270 bottom
R87  10K  [R0402]  24.35 46.61 270 bottom
R88  10K  [R0402]  13.84 34.4 90 bottom
R89  10K  [R0402]  12.47 34.42 90 bottom
SIM1  1040310811  [SIM-SMD_8P-1040310811]  13.19 42.8 0 bottom
SW17  -  [Key_SMD_4.2x3.2x2.5]  20.76 9.27 180 top
SW18  -  [Key_SMD_4.2x3.2x2.5]  5.38 9.27 180 top
SW19  -  [Key_SMD_4.2x3.2x2.5]  5.39 3.17 0 top
SW20  -  [Key_SMD_4.2x3.2x2.5]  20.88 3.17 0 top
SW21  -  [Key_SMD_4.2x3.2x2.5]  13.08 9.27 180 top
TYPE-C2  -  [USB-C_SMD-TYPE-C-31-M-12]  20.83 5.08 180 bottom
TYPE-C3  -  [USB-C_SMD-TYPE-C-31-M-12]  5.33 4.95 180 bottom
U11  VRD1228MTX  [SOT-23-6_L2.9-W1.6-P0.95-LS2.8-BL]  20.45 35.18 0 bottom
U12  ANT3216LL00R2400A  [ANT-SMD_L3.2-W1.6]  1.69 42.42 90 bottom
U15  CH343P  [TQFN-16_L3.0-W3.0-P0.50-BL-EP1.7]  2.58 11.76 0 bottom
X2  40MHz  [CRYSTAL-SMD_4P-L2.0-W1.6-BL]  2.33 18.03 270 bottom

## Footprints (pads in the part's own frame, mm; a bottom-side part is the same pattern mirrored in y, then rotated)
ANT-SMD_L3.2-W1.6
  rect 1.001x1.75 smd: 1(-1.577,0) 2(1.577,0)
C0402
  rect 0.79x0.54 smd: 1(-0.545,0) 2(0.545,0)
c0402_new
  rect 0.79x0.54 smd: 1(-0.545,0) 2(0.545,0)
CRYSTAL-SMD_4P-L2.0-W1.6-BL
  rect 1.1x0.8 smd: 1(-0.899,-0.574) 2(0.899,-0.574) 3(0.899,0.574) 4(-0.899,0.574)
FPC-SMD_24P-P0.50_SHOU-HAN_XGXJ-H2.0
  rect 0.3x1.3 smd: 1(-5.75,1.34) 2(-5.25,1.34) 3(-4.75,1.34) 4(-4.25,1.34) 5(-3.75,1.34) 6(-3.25,1.34) 7(-2.75,1.34) 8(-2.25,1.34) 9(-1.75,1.34) 10(-1.25,1.34) 11(-0.75,1.34) 12(-0.25,1.34) 13(0.25,1.34) 14(0.75,1.34) 15(1.25,1.34) 16(1.75,1.34) 17(2.25,1.34) 18(2.75,1.34) 19(3.25,1.34) 20(3.75,1.34) 21(4.25,1.34) 22(4.75,1.34) 23(5.25,1.34) 24(5.75,1.34)
  rect 2x1.6 smd: 25(7.45,-1.34) 26(-7.45,-1.34)
Key_SMD_4.2x3.2x2.5
  rect 1.049x0.701 smd: 1(-2.1,1.075) 2(2.1,1.075) 3(-2.1,-1.075) 4(2.1,-1.075)
l0402
  rect 0.79x0.54 smd: 1(-0.545,0) 2(0.545,0)
LED_0402
  rect 0.637x0.541 smd: 1(-0.538,0) 2(0.538,0)
Pad_e27
  oval 0.348x2 smd: 58(0,0)
Pad_e40
  oval 0.348x2 smd: 58(0,0)
Pad_e41
  oval 0.348x2 smd: 58(0,0)
Pad_e57
  oval 0.348x2 smd: 58(0,0)
Pad_e58
  oval 0.348x2 smd: 58(0,0)
Pad_e59
  oval 0.348x2 smd: 58(0,0)
Pad_e60
  oval 0.348x2 smd: 58(0,0)
Pad_e61
  oval 0.348x2 smd: 58(0,0)
Pad_e62
  oval 0.348x2 smd: 58(0,0)
Pad_e63
  oval 0.348x2 smd: 58(0,0)
Pad_e64
  oval 0.348x2 smd: 58(0,0)
Pad_e65
  oval 0.348x2 smd: 58(0,0)
QFN-56_L7.0-W7.0-P0.40-TL-EP4.0
  rect 0.665x0.2 smd: 1(-3.408,2.6) 2(-3.408,2.2) 3(-3.408,1.8) 4(-3.408,1.4) 5(-3.408,1) 6(-3.408,0.6) 7(-3.408,0.2) 8(-3.408,-0.2) 9(-3.408,-0.6) 10(-3.408,-1) 11(-3.408,-1.4) 12(-3.408,-1.8) 13(-3.408,-2.2) 14(-3.408,-2.6) 29(3.408,-2.6) 30(3.408,-2.2) 31(3.408,-1.8) 32(3.408,-1.4) 33(3.408,-1) 34(3.408,-0.6) 35(3.408,-0.2) 36(3.408,0.2) 37(3.408,0.6) 38(3.408,1) 39(3.408,1.4) 40(3.408,1.8) 41(3.408,2.2) 42(3.408,2.6)
  rect 0.2x0.665 smd: 15(-2.6,-3.408) 16(-2.2,-3.408) 17(-1.8,-3.408) 18(-1.4,-3.408) 19(-1,-3.408) 20(-0.6,-3.408) 21(-0.2,-3.408) 22(0.2,-3.408) 23(0.6,-3.408) 24(1,-3.408) 25(1.4,-3.408) 26(1.8,-3.408) 27(2.2,-3.408) 28(2.6,-3.408) 43(2.6,3.408) 44(2.2,3.408) 45(1.8,3.408) 46(1.4,3.408) 47(1,3.408) 48(0.6,3.408) 49(0.2,3.408) 50(-0.2,3.408) 51(-0.6,3.408) 52(-1,3.408) 53(-1.4,3.408) 54(-1.8,3.408) 55(-2.2,3.408) 56(-2.6,3.408)
  rect 4x4 smd: 57(0,0)
R0402
  rect 0.566x0.54 smd: 1(-0.433,0) 2(0.433,0)
r0402
  rect 0.566x0.54 smd: 1(-0.433,0) 2(0.433,0)
SIM-SMD_8P-1040310811
  rect 0.7x1.2 smd: 1(3.138,-5.338) 2(2.038,-5.338) 3(0.938,-5.338) 4(-0.163,-5.338) 5(-1.262,-5.338) 6(-2.362,-5.338) 7(-3.462,-5.338) 8(-4.562,-5.338)
  rect 1.17x1.8 smd: 9(-5.772,-5.138)
  rect 1.55x1.35 smd: 10(5.598,-5.312)
  rect 1.2x1 smd: 11(5.772,0.662) 12(5.772,4.362)
  rect 1.9x1.35 smd: 13(2.272,5.338) 14(-3.697,5.338)
SOD-523_L1.2-W0.8-LS1.6-BI
  rect 0.6x0.6 smd: 1(-0.75,0) 2(0.75,0)
SOIC-8_L5.3-W5.3-P1.27-LS8.0-BL
  oval 0.63x2.25 smd: 1(-1.905,-3.53) 2(-0.635,-3.53) 3(0.635,-3.53) 4(1.905,-3.53) 5(1.905,3.53) 6(0.635,3.53) 7(-0.635,3.53) 8(-1.905,3.53)
SOT-23-3_L2.9-W1.3-P1.90-LS2.4-BR
  rect 1.25x0.7 smd: 1(1,-0.95) 2(1,0.95) 3(-1,0)
SOT-23-5_L3.0-W1.7-P0.95-LS2.8-BL
  rect 0.49x1.157 smd: 1(-0.95,-1.153) 2(0,-1.153) 3(0.95,-1.153)
  rect 0.49x1.175 smd: 4(0.95,1.153) 5(-0.95,1.153)
SOT-23-6_L2.9-W1.6-P0.95-LS2.8-BL
  rect 0.532x1.072 smd: 1(-0.95,-1.149) 2(0,-1.149) 3(0.95,-1.149) 4(0.95,1.149) 5(0,1.149) 6(-0.95,1.149)
TQFN-16_L3.0-W3.0-P0.50-BL-EP1.7
  rect 0.25x0.75 smd: 1(-0.749,-1.45) 2(-0.248,-1.45) 3(0.252,-1.45) 4(0.751,-1.45) 9(0.75,1.45) 10(0.25,1.45) 11(-0.25,1.45) 12(-0.749,1.45)
  rect 0.75x0.25 smd: 5(1.45,-0.75) 6(1.45,-0.25) 7(1.45,0.25) 8(1.45,0.75) 13(-1.45,0.75) 14(-1.45,0.25) 15(-1.45,-0.25) 16(-1.45,-0.75)
  rect 1.7x1.7 smd: 17(0.001,0)
USB-C_SMD-TYPE-C-31-M-12
  oval 1.2x2 hole 0.8x1.6: 0(-4.325,1.716) 1(4.325,1.716)
  oval 1.2x1.8 hole 0.8x1.4: 2(4.325,-2.484) 3(-4.325,-2.484)
  rect 0.3x1.3 smd: A1(-3.35,2.484) A4(-2.55,2.484) A5(-1.25,2.484) A6(-0.25,2.484) A7(0.25,2.484) A8(1.25,2.484) A9(2.55,2.484) A12(3.35,2.484) B1(3.05,2.484) B4(2.25,2.484) B5(1.75,2.484) B6(0.75,2.484) B7(-0.75,2.484) B8(-1.75,2.484) B9(-2.25,2.484) B12(-3.05,2.484)

## Nets
As in the schematic, except:
GND: 16MB-NORFLASH0.4 C16.1 C17.2 C26.1 C27.1 C28.1 C29.1 C30.1 C32.1 C33.1 C34.1 C35.1 C36.2 C37.2 C38.1 C39.1 C70.2 C71.2 C73.2 C76.1 C77.1 C78.1 C79.2 C80.2 C81.2 D3.1 ESP32-S3.57 LDO1.2 LED1.1 NOREF#3.58 NOREF#5.58 NOREF#7.58 NOREF#10.58 OV2640.1 OV2640.10 OV2640.23 OV2640.25 OV2640.26 Q2.2 R76.1 R77.1 R78.1 R89.2 SIM1.6 SIM1.9 SIM1.10 SIM1.11 SIM1.13 SIM1.14 SW19.1 SW19.2 SW20.1 SW20.2 TYPE-C2.0 TYPE-C2.1 TYPE-C2.2 TYPE-C2.3 TYPE-C2.A1 TYPE-C2.A12 TYPE-C2.B1 TYPE-C2.B12 TYPE-C3.0 TYPE-C3.1 TYPE-C3.2 TYPE-C3.3 TYPE-C3.A1 TYPE-C3.A12 TYPE-C3.B1 TYPE-C3.B12 U11.5 U15.2 U15.17 X2.2 X2.4
VDD3P3: C16.2 C26.2 C27.2 C28.2 C32.2 C33.2 C38.2 C78.2 C79.1 C80.1 C81.1 ESP32-S3.20 ESP32-S3.46 ESP32-S3.55 ESP32-S3.56 L3.1 LDO1.5 NOREF#2.58 NOREF#4.58 OV2640.2 OV2640.14 R10.1 R71.2 R74.1 R75.1 R79.1 R80.1 R82.2 R83.2 R84.2 R85.2 R86.2 R87.2 R88.2 SIM1.4 U15.1
CS: ESP32-S3.23 NOREF#11.58
D/C: ESP32-S3.24 NOREF.58
LEDK: NOREF#9.58 Q2.3
RESET: ESP32-S3.19 NOREF#6.58
SCL: ESP32-S3.22 NOREF#8.58
SDA: ESP32-S3.21 NOREF#12.58

Pads without a net: ESP32-S3 28 38 39 40 41 42; LDO1 4; OV2640 24; TYPE-C2 A5 A8 B5 B8; TYPE-C3 A5 A8 B5 B8; U12 2; U15 10 11 12 13 14 15 16

## Via types
v1: diameter 0.5, hole 0.305, Top Layer to Bottom Layer, 114 vias
v2: diameter 0.482, hole 0.305, Top Layer to Bottom Layer, 39 vias

## Routing (per net, layer and track width the routed paths; a pad name or vN(x,y) marks a point on that pad's centre or on a via; arc(x,y) is an arc through that point)
GND: length 9.4
  Bottom Layer w0.127: 2.84,14.45 2.84,14.27 2.34,13.76 2.34,12.01 U15.17
  Bottom Layer w0.203: 23.88,7.56 24.38,7.56 25.15,6.8 ; 17.78,7.56 17.27,7.56 16.5,6.8 ; TYPE-C3.B1 TYPE-C3.A12 1.78,7.44 TYPE-C3.1 ; TYPE-C3.0 8.89,7.44 TYPE-C3.A1 TYPE-C3.B12
  vias: v1(0.63,38.73) v1(0.63,37.59) v1(0.63,36.45) v1(0.63,35.31) v1(0.63,34.16) v1(0.63,33.02) v1(0.63,31.88) v1(0.63,25.65) v1(0.63,24.64) v1(1.27,47.88) v1(1.27,46.86) v1(1.27,45.85) v1(1.4,22.73) v1(1.78,38.73) v1(1.78,37.59) v1(1.78,36.45) v1(1.78,35.31) v1(1.78,34.16) v1(1.78,33.02) v1(1.78,31.88) v1(1.78,25.65) v1(2.29,23.75) v1(2.29,22.35) v1(3.43,23.37) v1(3.43,22.35) v1(3.81,17.14) v1(3.81,15.75) v1(4.06,43.81) v1(4.32,18.42) v1(4.83,41.4) v1(4.83,40.51) v1(6.1,47.88) v1(6.35,24.13) v1(6.35,23.37) v1(6.35,22.35) v1(6.73,12.32) v1(7.49,12.32) v1(7.49,11.56) v1(8.51,30.61) v1(8.51,29.46) v1(8.51,24.51) v1(8.76,45.34) v1(8.76,44.45) v1(9.78,30.61) v1(9.78,29.46) v1(10.16,27.56) v1(11.68,37.47) v1(11.94,29.84) v1(11.94,28.96) v1(11.94,27.56) v1(13.2,37.48) v1(17.53,36.32) v1(21.97,21.34) v1(23.11,21.34) v1(23.88,29.34) v1(23.88,27.94) v1(23.88,9.4) v2(3.05,11.43) v2(3.43,24.38) v2(5.97,15.49) v2(6.73,11.56) v2(6.83,15.49) v2(6.86,32.77) v2(7.62,32.77) v2(7.58,9.27) v2(10.79,42.16) v2(10.92,14.22) v2(11.56,9.27) v2(11.68,38.48) v2(13.21,43.43) v2(13.2,42.16) v2(13.2,38.48) v2(13.21,33.15) v2(14.6,9.28) v2(15.62,43.43) v2(15.62,42.16) v2(19.18,12.95) v2(19.18,12.17) v2(19.23,9.27) v2(20.57,23.11) v2(20.57,22.23) v2(20.57,21.34) v2(21.34,43.69) v2(21.34,41.78) v2(21.34,39.75) v2(21.72,16.26) v2(21.72,15.37) v2(21.72,12.95) v2(21.72,12.17) v2(21.72,9.28) v2(21.97,24.13) v2(23.13,24.13) v2(24.38,43.69) v2(24.38,41.78) v2(24.38,39.75)
VBUS: length 89.8
  Top Layer w0.203: v1(3.81,13.97) 3.81,12.19 4.32,11.68 v1(5.59,11.68)
  Top Layer w0.305: LDO1.1 24.76,15.93 v1(24.76,17.27) ; R73.2 24.76,17.3
  Top Layer w0.355: v1(22.86,36.83) 23.62,36.83 24.76,35.69 v1(24.76,17.27)
  Bottom Layer w0.127: v1(3.81,13.97) 3.08,13.97 2.84,13.72 2.84,13.21
  Bottom Layer w0.203: v1(5.59,11.68) 5.59,10.29 7.58,8.29 TYPE-C3.B9 ; C17.1 22.86,37.9 v1(22.86,36.83)
  Bottom Layer w0.254: 20.7,5.97 20.7,2.54 19.3,1.14 6.6,1.14 5.33,2.41 5.33,5.95 5.31,5.97 ; 20.7,5.97 19.37,5.97 18.58,6.77 18.58,7.56 18.28,7.56 ; 20.7,5.97 22.28,5.97 23.08,6.77 23.08,7.56 ; U11.1 U11.2 U11.3 22.36,36.33 v1(22.86,36.83) ; 5.31,5.97 3.75,5.97 3.08,6.64 TYPE-C3.B4 TYPE-C3.A9 2.78,9.26 3.33,9.81 U15.9 ; 5.31,5.97 6.91,5.97 7.58,6.64 TYPE-C3.B9
  Bottom Layer w0.355: 23.08,7.56 23.08,16.6 23.75,17.27 v1(24.76,17.27)
VCC_SPI: length 12.5
  Top Layer w0.127: C30.2 C29.2 v1(17.27,15.24)
  Bottom Layer w0.127: ESP32-S3.29 15.6,15.24 v1(17.27,15.24) 18.03,15.24 18.29,14.99 18.29,9.91 17.91,9.53 16MB-NORFLASH0.8
VDD1V2: length 13.3
  Top Layer w0.203: v1(14.73,27.94) v1(17.27,27.94) 17.28,27.94
  Bottom Layer w0.203: OV2640.15 14.47,27.67 v1(14.73,27.94) ; v1(17.27,27.94) 17.27,30.99 19.5,33.21 U11.6 17.59,34.03 C70.1
VDD2V8: length 11.4
  Bottom Layer w0.203: OV2640.21 17.47,27.37 17.91,27.81 17.91,29.72 21.4,33.21 U11.4 23.4,34.03 C71.1
VDD3P3: length 204.1
  Top Layer w0.127: v1(10.41,17.78) 10.41,16.4 10.4,16.39 ; C28.2 15.68,19.62 v1(15.49,19.43)
  Top Layer w0.203: R79.1 11.94,6.35 12.32,6.73 13.84,6.73 14.22,6.35 R80.1 18.59,5.26 20.41,7.07 23.44,7.07 23.73,7.37 23.75,7.37 23.75,8.25 24.26,8.76 25.13,8.76 25.27,8.9 25.27,10.97 25.07,11.18 v1(24.76,11.18) 18.92,11.18 15.49,14.61 v1(15.49,19.43) ; 0.63,13.2 0.64,13.21 v2(1.27,13.21)
  Top Layer w0.305: 1.58,20.07 C32.2 ; C32.2 1.65,20.05 v1(1.65,21.46) ; C32.2 C33.2 1.59,19.05 0.63,19.05 ; 0.63,19.05 0.63,12.57 1.08,12.13 1.52,12.13 ; 0.63,19.05 0.63,23.24 2.79,25.4 2.79,36.7 ; NOREF#2.58 NOREF#4.58 18.84,32.55 19.05,32.77 v1(22.86,32.77) ; 2.79,36.7 v1(5.97,36.7) ; 2.79,36.7 2.79,44.45 3.3,44.96 5.46,44.96 5.97,45.47 v1(5.97,46.1) v1(12.45,46.1) v1(19.81,46.1) ; LDO1.5 24.81,11.22 v1(24.76,11.18)
  Bottom Layer w0.127: ESP32-S3.20 15.71,19.27 15.55,19.43 v1(15.49,19.43) ; ESP32-S3.55 10.25,20.87 10.41,20.7 v1(10.41,17.78) 10.41,17.38 10.31,17.27 ESP32-S3.46 ; 1.84,13.21 1.84,14.36 1.75,14.45
  Bottom Layer w0.203: OV2640.14 13.97,27.18 12.83,28.32 11.05,28.32 ; 11.05,28.32 9.14,28.32 7.97,27.14 OV2640.2 ; 11.05,28.32 11.05,34.94 10.92,35.07 C16.2 10.46,35.73 10.67,35.94 13.46,35.94 13.82,35.58 13.82,34.85 R75.1 ; 1.83,13.21 v2(1.27,13.21) ; 24.31,46.1 24.38,46.18 24.38,46.1 ; ESP32-S3.55 ESP32-S3.56 1.84,21.27 v1(1.65,21.46) ; 22.94,31.55 22.86,31.63 v1(22.86,32.77) ; v1(12.45,46.1) 13.03,46.69 13.03,48.64
  Bottom Layer w0.305: v1(5.97,36.7) C27.2 C38.2 C26.2 L3.1 C16.2 ; 25.95,21.13 25.95,45.68 25.53,46.1 v1(19.81,46.1) ; 25.95,21.13 24.83,21.13 ; 25.95,21.13 25.95,11.78 25.35,11.18 v1(24.76,11.18) ; v1(5.97,46.1) 2.83,46.1 2.78,46.15 2.78,46.18 ; v1(22.86,32.77) 25.73,32.77
CAMERA_D2: length 6.6
  Bottom Layer w0.127: OV2640.6 9.97,25.47 10.64,24.79 11.72,24.79 13.98,22.54 ESP32-S3.10
CAMERA_D3: length 6.8
  Bottom Layer w0.127: ESP32-S3.8 13.18,22.51 11.35,24.34 10.08,24.34 8.97,25.45 OV2640.4
CAMERA_D4: length 6.9
  Bottom Layer w0.127: ESP32-S3.7 12.78,22.51 11.18,24.11 9.8,24.11 8.47,25.44 OV2640.3
CAMERA_D5: length 6.7
  Bottom Layer w0.127: ESP32-S3.9 13.58,22.56 11.57,24.57 10.36,24.57 9.47,25.46 OV2640.5
CAMERA_D6: length 6.5
  Bottom Layer w0.127: OV2640.7 10.47,25.48 10.92,25.02 11.88,25.02 14.38,22.52 ESP32-S3.11
CAMERA_D7: length 6.2
  Bottom Layer w0.127: OV2640.9 11.47,25.61 11.59,25.48 12.18,25.48 15.18,22.48 ESP32-S3.13
CAMERA_D8: length 5.6
  Bottom Layer w0.127: OV2640.11 12.47,25.63 15.58,22.52 ESP32-S3.14
CAMERA_D9: length 7.5
  Bottom Layer w0.127: ESP32-S3.16 16.92,20.87 17.02,20.97 17.02,21.97 13.47,25.52 OV2640.13
CAMERA_HREF: length 7.4
  Bottom Layer w0.127: OV2640.16 14.97,24.35 17.25,22.07 17.25,20.87 16.84,20.47 ESP32-S3.17
CAMERA_PCLK: length 6.3
  Bottom Layer w0.127: ESP32-S3.12 14.78,22.5 12.03,25.25 11.2,25.25 10.97,25.48 OV2640.8
CAMERA_PWDN: length 8.9
  Bottom Layer w0.127: R89.1 12.47,31.73 15.47,28.73 OV2640.17
CAMERA_RET: length 8.7
  Bottom Layer w0.127: OV2640.19 16.47,29.76 13.85,32.38 13.85,33.98
CAMERA_SIOC: length 22.7
  Top Layer w0.127: v1(11.94,16.26) 12.7,17.02 14.35,17.02 14.73,17.4 14.73,23.11 v1(16.51,24.89)
  Bottom Layer w0.127: R75.2 15.24,32.39 16.76,30.86 16.76,27.43 16.97,27.23 OV2640.20 16.97,25.35 v1(16.51,24.89) ; v1(11.94,16.26) 12.38,15.82 ESP32-S3.37
CAMERA_SIOD: length 22.5
  Top Layer w0.127: v1(16.51,24) 16.45,24 14.99,22.54 14.99,17.33 14.42,16.76 13.21,16.76 v1(12.7,16.26)
  Bottom Layer w0.127: ESP32-S3.36 12.78,16.18 v1(12.7,16.26) ; v1(16.51,24) 17.97,25.46 OV2640.22 17.97,27.24 18.29,27.56 18.29,29.46 19.51,30.68 22.94,30.68
CAMERA_VSYNC: length 7.6
  Bottom Layer w0.127: ESP32-S3.18 16.77,20.07 17.47,20.78 17.47,22.16 15.97,23.67 OV2640.18
CAMERA_XCLK: length 6.5
  Bottom Layer w0.127: ESP32-S3.15 16.38,22.1 12.97,25.52 OV2640.12
CHIP_PU: length 33.1
  Top Layer w0.127: v1(10.92,21.21) 9.53,21.21 9.02,20.7 9.02,13.34 10.15,13.34 12.7,10.78 v1(12.7,9.53) ; SW19.4 8.39,2.1 8.64,2.35 8.64,3.81 9.14,4.32 12.48,4.32 12.7,4.54 v1(12.7,6.1)
  Top Layer w0.203: SW19.4 SW19.3
  Bottom Layer w0.127: ESP32-S3.4 11.58,21.48 11.31,21.21 v1(10.92,21.21) ; v1(12.7,9.53) v1(12.7,6.1)
CS: length 18.2
  Top Layer w0.127: v1(19.3,24.51) 19.3,28.45 18.54,29.21 16.13,29.21 15.36,29.98 NOREF#11.58
  Bottom Layer w0.127: ESP32-S3.23 17.43,18.07 19.3,19.94 v1(19.3,24.51)
D+: length 6.7
  Bottom Layer w0.127: TYPE-C3.A6 5.58,8.26 5.46,8.38 5.09,8.38 ; 5.09,8.38 5.09,11.17 4.75,11.51 U15.7 ; 5.09,8.38 4.7,8.38 4.58,8.27 TYPE-C3.B6
D-: length 8.1
  Top Layer w0.127: v1(4.32,8.89) v1(5.84,8.89)
  Bottom Layer w0.127: 5.59,6.47 5.58,6.48 ; 5.58,6.48 5.96,6.48 6.08,6.6 TYPE-C3.B7 6.08,8.65 v1(5.84,8.89) ; 5.58,6.48 5.21,6.48 5.08,6.6 TYPE-C3.A7 ; v1(4.32,8.89) 4.03,9.17 U15.8
D/C: length 18.9
  Top Layer w0.127: NOREF.58 16.05,30.05 16.38,29.72 18.8,29.72 19.81,28.7 v1(19.81,23.88)
  Bottom Layer w0.127: v1(19.81,23.88) 19.81,19.69 17.8,17.67 ESP32-S3.24
D_OTG+: length 14.9
  Bottom Layer w0.127: ESP32-S3.26 18.56,16.87 20.08,15.36 20.08,7.56 20.07,7.55 20.07,6.73 20.19,6.6 20.96,6.6 21.08,6.73 21.08,7.56
D_OTG-: length 14.7
  Bottom Layer w0.127: ESP32-S3.25 18.8,17.27 20.57,15.49 20.57,8.51 ; 20.57,8.51 20.57,7.57 20.58,7.56 ; 20.57,8.51 21.46,8.51 21.58,8.39 21.58,7.56
GPIO0: length 33.8
  Top Layer w0.127: SW20.3 18.71,2.03 17.85,2.03 17.53,2.36 17.53,3.68 16.89,4.32 13.71,4.32 13.46,4.57 v1(13.46,6.1) ; v1(12.57,21.21) 12.11,20.74 9.53,20.74 9.4,20.62 9.4,14.61 13.46,10.54 v1(13.46,9.53)
  Top Layer w0.203: SW20.4 SW20.3
  Bottom Layer w0.127: v1(13.46,9.53) v1(13.46,6.1) ; v1(12.57,21.21) 12.24,21.21 11.98,21.47 ESP32-S3.5
GPIO1: length 45.2
  Top Layer w0.203: v1(11.43,22.99) 9.53,22.99 8.5,21.96 8.5,15.99 7.24,14.73 2.92,14.73 2.16,13.97 2.16,11.46 1.96,11.26 R71.1 1.47,11.2 1.47,9.2 2.47,8.2 SW18.2 ; SW17.2 SW17.1
  Top Layer w0.254: SW17.2 SW21.1 SW21.2 SW18.1 SW18.2
  Bottom Layer w0.127: v1(11.43,22.99) 11.47,22.95 12.01,22.95 12.38,22.59 ESP32-S3.6
GPIO38: length 51.5
  Top Layer w0.127: v1(5.59,17.4) 5.59,19.14 4.78,19.96 4.78,30.89 4.57,31.09 v1(4.57,31.75)
  Bottom Layer w0.127: v1(5.59,17.4) 5.59,16.89 6.41,16.07 ESP32-S3.43 ; 2.84,47.04 2.84,48.56 3.79,49.51 11.32,49.51 11.93,48.9 SIM1.5 11.93,46.96 4.01,39.04 4.01,32.31 v1(4.57,31.75) ; 2.78,47.04 2.79,47.05
GPIO39: length 53.6
  Top Layer w0.127: v1(6.1,17.91) 6.1,18.96 5,20.05 5,31.17 v1(5.08,31.24)
  Bottom Layer w0.127: v1(6.1,17.91) 6.1,16.97 6.59,16.47 ESP32-S3.44 ; 24.38,47.04 24.38,47.63 22.53,49.48 14.68,49.48 14.13,48.93 SIM1.3 14.13,46.75 12.85,45.47 10.76,45.47 4.24,38.95 4.24,32.97 5.08,32.13 v1(5.08,31.24)
GPIO40: length 51.5
  Top Layer w0.127: v1(5.59,31.75) 5.59,31.06 5.23,30.71 5.23,20.14 6.32,19.05 6.32,18.34 6.6,18.06 v1(6.6,17.4)
  Bottom Layer w0.127: ESP32-S3.45 6.82,16.87 6.6,17.09 v1(6.6,17.4) ; v1(5.59,31.75) 5.59,32 4.47,33.12 4.47,38.85 10.86,45.24 13.61,45.24 15.24,46.86 15.24,48.13 SIM1.2 15.23,48.89 15.6,49.25 21.62,49.25 23.24,47.63 R82.1
GPIO41: length 49.5
  Top Layer w0.127: v1(6.1,31.24) 5.46,30.61 5.46,20.24 6.55,19.15 6.55,18.47 v1(7.11,17.91)
  Bottom Layer w0.127: 22.15,47.04 22.15,47.57 20.7,49.02 16.46,49.02 16.33,48.89 SIM1.1 16.33,46.94 14.4,45.01 10.95,45.01 4.7,38.76 4.7,33.3 6.1,31.9 v1(6.1,31.24) 6.05,31.28 ; v1(7.11,17.91) 7.11,17.53 7.37,17.27 8.52,17.27 8.92,17.67 ESP32-S3.47
GPIO42: length 39.9
  Top Layer w0.127: v1(6.6,31.75) 6.6,31.09 5.72,30.2 5.72,20.31 6.78,19.24 6.78,19 v1(7.87,17.91)
  Bottom Layer w0.127: SIM1.12 18.97,39.07 18.29,39.75 6.02,39.75 4.93,38.66 4.93,33.42 v1(6.6,31.75) ; v1(7.87,17.91) 8.04,18.07 ESP32-S3.48
GPIO45: length 45.5
  Top Layer w0.127: v1(4.06,31.24) 4.1,31.24 4.55,30.8 4.55,19.86 4.83,19.58 v1(4.83,18.92)
  Bottom Layer w0.127: ESP32-S3.51 5.17,19.27 v1(4.83,18.92) ; 3.94,47.04 3.94,48.39 4.83,49.28 9.39,49.28 9.73,48.94 SIM1.7 9.73,46.97 3.78,41.02 3.78,32.18 4.06,31.9 v1(4.06,31.24)
GPIO46: length 42.4
  Top Layer w0.127: v1(3.56,31.75) 3.56,31.09 4.32,30.33 v1(4.32,19.43)
  Bottom Layer w0.127: v1(4.32,19.43) 4.56,19.67 ESP32-S3.52 ; 5.13,47.04 5.13,48.31 5.87,49.05 8.48,49.05 8.64,48.89 8.64,48.14 SIM1.8 8.63,46.19 3.56,41.11 v1(3.56,31.75)
LCDK: length 2.4
  Top Layer w0.127: R24.2 17.53,16.51 v1(17.27,16.26)
  Bottom Layer w0.127: v1(17.27,16.26) 17.06,16.47 ESP32-S3.27
LEDK: length 12.9
  Top Layer w0.203: NOREF#9.58 19.56,31.34 19.56,29.84 21.34,28.07 21.34,20.16 21.15,19.97 Q2.3
RESET: length 16.1
  Top Layer w0.127: NOREF#6.58 13.27,27.88 14.48,26.67 17.3,26.67 17.78,26.19 v1(17.78,23.88)
  Bottom Layer w0.127: ESP32-S3.19 16.88,19.67 17.78,20.57 v1(17.78,23.88)
RXD: length 2.7
  Bottom Layer w0.127: U15.5 4.03,12.83 5.08,13.88 5.08,14.78 R56.2
SCL: length 17.9
  Top Layer w0.127: NOREF#8.58 14.66,29.28 15.24,28.7 18.29,28.7 18.8,28.19 v1(18.8,23.88)
  Bottom Layer w0.127: v1(18.8,23.88) 18.8,20.07 17.2,18.47 ESP32-S3.22
SDA: length 17
  Top Layer w0.127: v1(18.29,24.51) 18.29,26.42 17.53,27.18 14.73,27.18 13.97,27.95 NOREF#12.58
  Bottom Layer w0.127: ESP32-S3.21 16.84,18.87 18.29,20.32 v1(18.29,24.51)
SPICLK: length 5.1
  Bottom Layer w0.127: ESP32-S3.33 13.97,15.25 13.97,13.08 14.99,12.06 16MB-NORFLASH0.6
SPICS0: length 16.4
  Bottom Layer w0.127: 16MB-NORFLASH0.1 10.77,9.53 11.05,9.8 11.05,10.73 11.75,11.43 17.65,11.43 17.82,11.59 17.82,13.81 17.14,14.48 14.6,14.48 14.38,14.71 ESP32-S3.32
SPID: length 5.6
  Top Layer w0.127: v1(12.83,13.97) v1(14.86,13.97)
  Bottom Layer w0.127: v1(12.83,13.97) 13.18,14.32 ESP32-S3.35 ; v1(14.86,13.97) 14.86,13.5 15.02,13.34 16MB-NORFLASH0.5
SPIHD: length 8.2
  Bottom Layer w0.127: ESP32-S3.30 15.18,14.84 15.3,14.71 17.23,14.71 18.05,13.9 18.05,11.06 17.78,10.8 16MB-NORFLASH0.7
SPIQ: length 7
  Bottom Layer w0.127: 16MB-NORFLASH0.2 10.79,10.8 13.58,13.58 ESP32-S3.34
SPIWP: length 8.9
  Top Layer w0.127: v1(12.06,13.97) 12.57,14.48 13.84,14.48 14.6,15.24 v1(14.6,16.26)
  Bottom Layer w0.127: ESP32-S3.31 14.78,16.08 v1(14.6,16.26) ; v1(12.06,13.97) 12.06,13.36 10.77,12.06 16MB-NORFLASH0.3
TXD: length 10.8
  Bottom Layer w0.127: 3.34,13.21 3.71,13.21 4.44,13.95 4.44,17.76 5.56,18.87 ESP32-S3.50
$1N4290: length 7
  Bottom Layer w0.127: 5.2,15.65 5.08,15.77 5.08,17.78 5.77,18.47 ESP32-S3.49
$1N4308: length 12
  Bottom Layer w0.127: ESP32-S3.53 3.81,20.07 3.68,19.94 3.68,18.16 3.56,18.03 1.87,18.03 1.76,17.93 X2.3 1.76,15.67 C37.1
$1N4325: length 16.2
  Bottom Layer w0.127: L3.2 9.34,32.45 7.11,30.23 7.11,27.65 6.86,27.4 6.86,25.02 v1(7.87,24) 8.38,23.5 10.54,23.5 10.78,23.26 ESP32-S3.2
  Bottom Layer w0.203: ESP32-S3.3 ESP32-S3.2
$1N4347: length 14.6
  Bottom Layer w0.203: ESP32-S3.1 10.38,22.48 arc(10.29,22.75) 10.03,22.86 2.99,22.86 arc(1.78,23.33) 1.21,24.51 C35.2 L4.2
$1N4357: length 11.8
  Bottom Layer w0.203: U12.1 1.21,40.84 C34.2 L4.1
$1N6114: length 1.2
  Bottom Layer w0.305: LED1.2 24.83,19.08 R10.2
$1N8529: length 2.2
  Top Layer w0.203: v1(5.08,12.32) 5.14,12.38 5.14,13.34
  Bottom Layer w0.127: U15.6 4.77,12.01 v1(5.08,12.32)
$1N9307: length 5.9
  Top Layer w0.203: R78.2 9.15,10.35 SW18.3 SW18.4
$1N9342: length 6.2
  Top Layer w0.203: 17,10.29 16.95,10.35 SW21.3 14.28,10.35 v1(14.1,10.16) ; SW21.4 11.88,10.35 v1(12.06,10.16)
  Bottom Layer w0.203: v1(12.06,10.16) v1(14.1,10.16)
$1N11471: length 6
  Top Layer w0.203: R76.2 24.58,10.35 SW17.3 SW17.4
$1N13673: length 8.4
  Bottom Layer w0.127: C36.1 2.92,20.39 2.92,18.82 2.91,18.81 ; ESP32-S3.54 2.87,20.47
$1N21988: length 1.5
  Top Layer w0.127: Q2.1 19.46,17.94 R24.1
$1N24418: length 1.4
  Top Layer w0.305: LDO1.3 22.96,15.93 R73.1

## Copper pours and planes (outline as drawn; the poured copper is in the pictures)
GND on Top Layer: -1.91,51.94 27.69,51.94 27.69,-1.4 -1.91,-1.4
GND on Bottom Layer: -3.05,52.07 27.31,52.07 27.31,-1.91 -3.05,-1.91
